# Altium schematic sheet BLE.SchDoc: RF/Bluetooth
size B; Author: Sébastien Gélinas; Organization: SmartHalo; Address1: 5445 de Gaspé; Address2: Montréal, QC; Address3: Canada; Address4: H2T 3B2; DocumentNumber: 4; Revision: 1; SheetNumber: 4; SheetTotal: 4
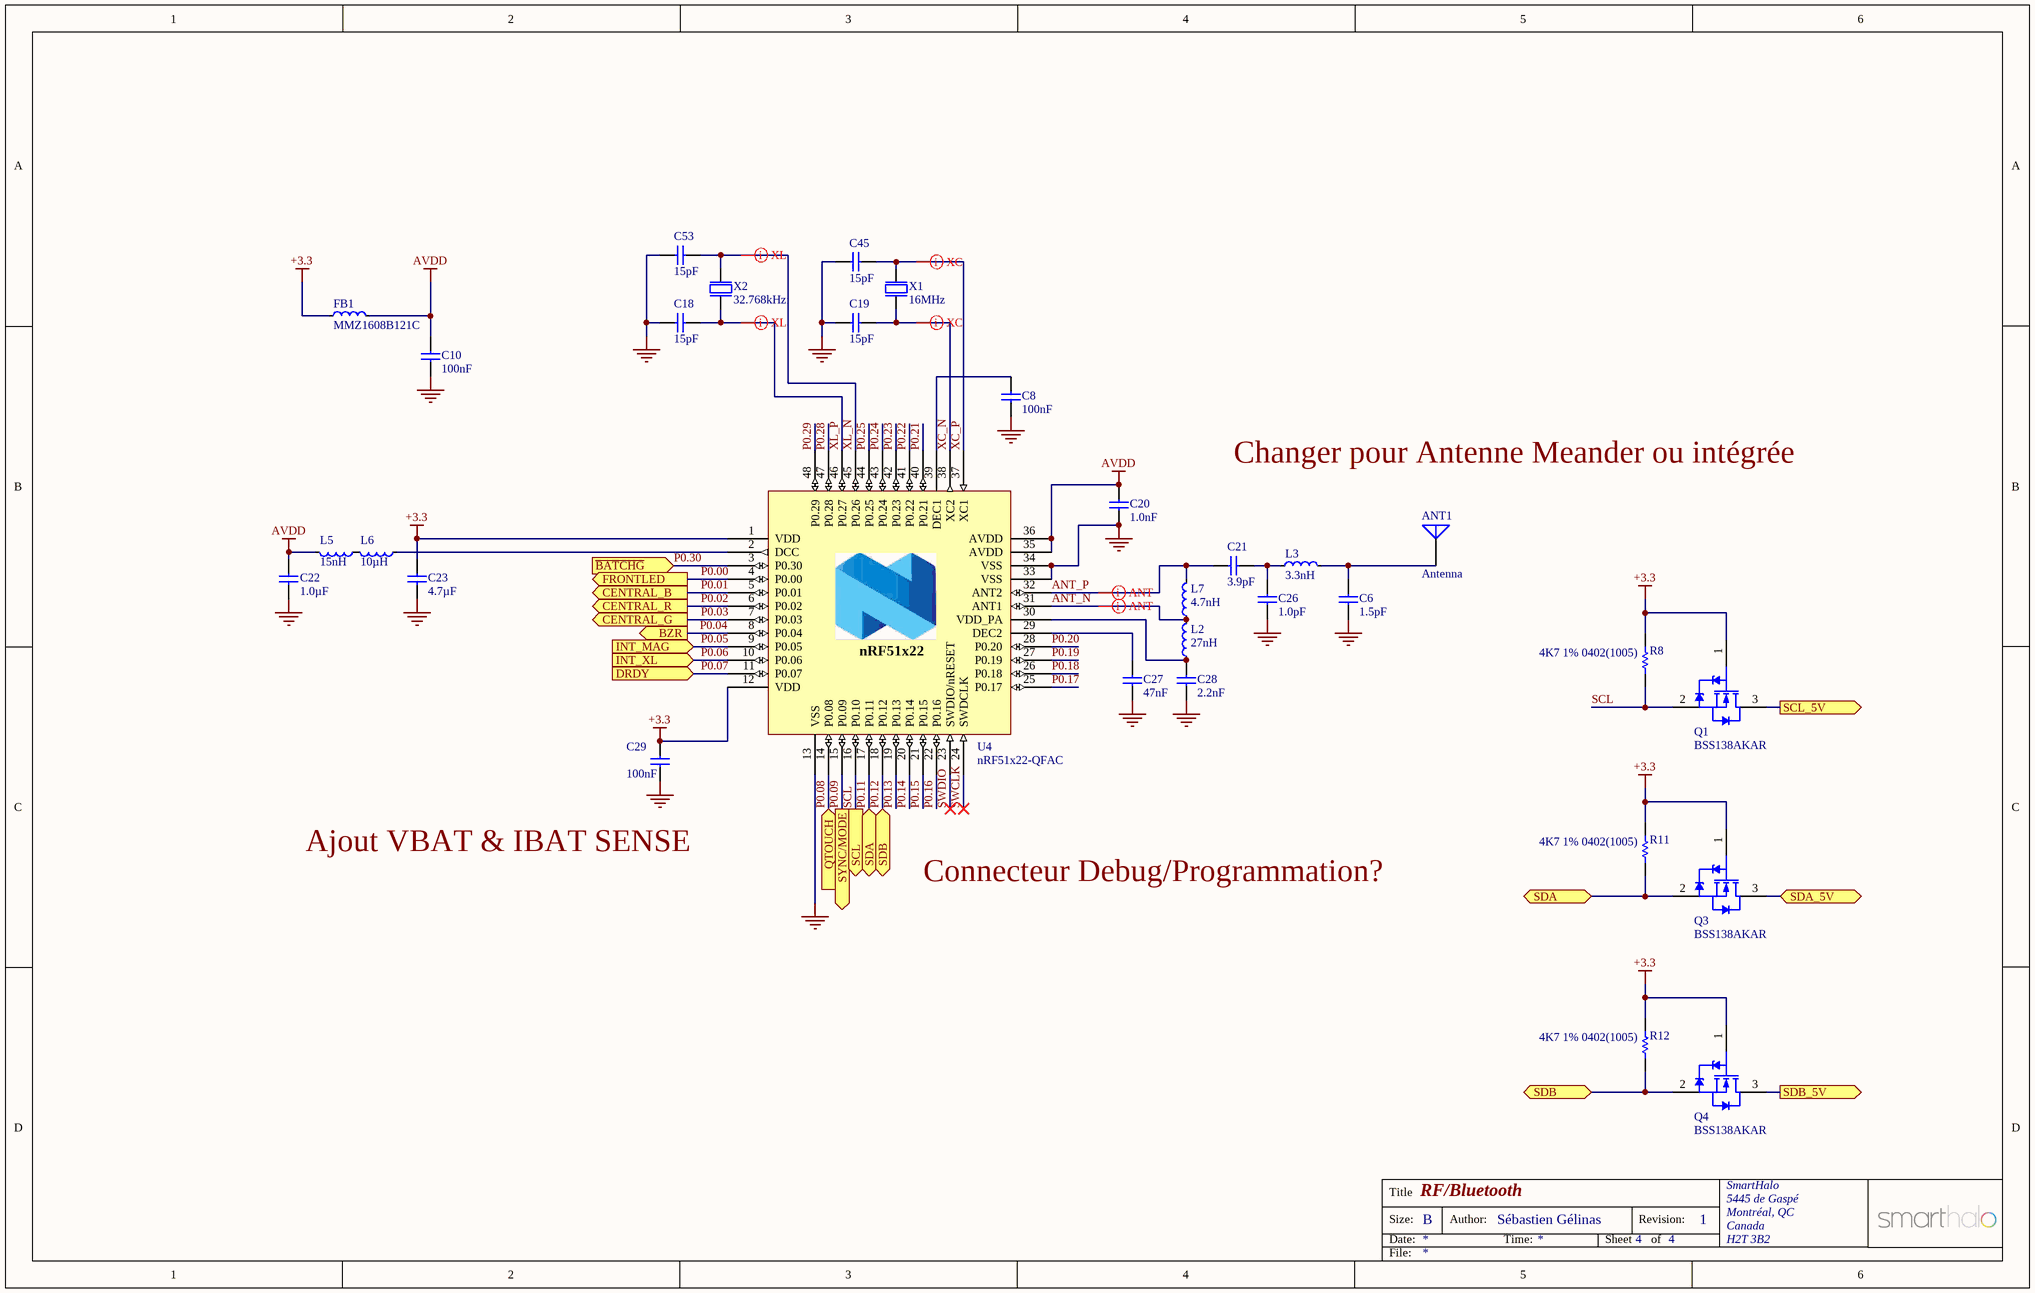
[diagram p0: BLE.SchDoc]

## Parts
ANT1  Antenna  [ANTENNA_PCB_2.4GHZ]  (no BOM)
C6  1.5pF  [CAPC1005X04L]
C8  100nF  [CAPC1005X04L]
C10  100nF  [CAPC0805(2012)100_N]
C18  15pF  [CAPC0805(2012)100_N]
C19  15pF  [CAPC0805(2012)100_N]
C20  1.0nF  [CAPC1005X04L]
C21  3.9pF  [CAPC1005X04L]
C22  1.0µF  [CAPC1608X06L]
C23  4.7µF  [CAPC1608X06L]
C26  1.0pF  [CAPC1005X04L]
C27  47nF  [CAPC1005X04L]
C28  2.2nF  [CAPC1005X04L]
C29  100nF  [CAPC1005X04L]
C45  15pF  [CAPC0805(2012)100_N]
C53  15pF  [CAPC0805(2012)100_N]
FB1  MMZ1608B121C  [CAPC0805(2012)100_N]
L2  27nH  [INDC1005X04L]
L3  3.3nH  [INDC1005X04L]
L5  15nH  [INDC1005X04L]
L6  10µH  [INDC1608X06L]
L7  4.7nH  [INDC1005X04L]
Q1  BSS138AKAR  [NXP-SOT23_N]
Q3  BSS138AKAR  [NXP-SOT23_N]
Q4  BSS138AKAR  [NXP-SOT23_N]
R8  4K7 1% 0402(1005)  [RESC0402(1005)_N]
R11  4K7 1% 0402(1005)  [RESC0402(1005)_N]
R12  4K7 1% 0402(1005)  [RESC0402(1005)_N]
U4  nRF51x22-QFAC  [QFN40P600X600X90-48N]
X1  16MHz  [CRYSTAL_16MHz_SMT4]
X2  32.768kHz  [CRYSTAL_32.768kHz_SMT2]

## Ports
BZR (out), CENTRAL_B (out), CENTRAL_G (out), CENTRAL_R (out), DRDY (in), FRONTLED (out), INT_MAG (in), INT_XL (in), QTOUCH (in), SCL (out), SCL_5V (out), SDA (bidir), SDA_5V (bidir), SDB (bidir), SDB_5V (out), SYNC/MODE (out), ~{BATCHG} (in)

## Nets
+3.3: C23.1 C29.1 FB1.1 Q1.1(G) Q3.1(G) Q4.1(G) R8.2 R11.2 R12.2 U4.1(VDD) U4.12(VDD)
AVDD: C10.2 C20.1 C22.2 FB1.2 L5.2 U4.35(AVDD) U4.36(AVDD)
GND: C6.2 C8.2 C10.1 C18.1 C19.2 C20.2 C22.1 C23.2 C26.2 C27.2 C28.2 C29.2 C45.2 C53.1 U4.13(VSS) U4.33(VSS) U4.34(VSS) U4.49 X1.2(GND) X1.4(GND)
ANT_N: L2.2 L7.1 U4.31(ANT1)
ANT_P: C21.1 L7.2 U4.32(ANT2)
P0.00: U4.4(P0.00) ; port FRONTLED
P0.01: U4.5(P0.01) ; port CENTRAL_B
P0.02: U4.6(P0.02) ; port CENTRAL_R
P0.03: U4.7(P0.03) ; port CENTRAL_G
P0.04: U4.8(P0.04) ; port BZR
P0.05: U4.9(P0.05) ; port INT_MAG
P0.06: U4.10(P0.06) ; port INT_XL
P0.07: U4.11(P0.07) ; port DRDY
P0.08: U4.14(P0.08) ; port QTOUCH
P0.09: U4.15(P0.09) ; port SYNC/MODE
P0.11: Q3.2(S) R11.1 U4.17(P0.11) ; port SDA
P0.12: Q4.2(S) R12.1 U4.18(P0.12) ; port SDB
P0.13: U4.19(P0.13)
P0.14: U4.20(P0.14)
P0.15: U4.21(P0.15)
P0.16: U4.22(P0.16)
P0.17: U4.25(P0.17)
P0.18: U4.26(P0.18)
P0.19: U4.27(P0.19)
P0.20: U4.28(P0.20)
P0.21: U4.40(P0.21)
P0.22: U4.41(P0.22)
P0.23: U4.42(P0.23)
P0.24: U4.43(P0.24)
P0.25: U4.44(P0.25)
P0.28: U4.47(P0.28)
P0.29: U4.48(P0.29)
P0.30: U4.3(P0.30) ; port ~{BATCHG}
SCL: Q1.2(S) R8.1 U4.16(P0.10) ; port SCL
SCL_5V: Q1.3(D) ; port SCL_5V
SDA_5V: Q3.3(D) ; port SDA_5V
SDB_5V: Q4.3(D) ; port SDB_5V
SWCLK: U4.24(SWDCLK)
SWDIO: U4.23(SWDIO/nRESET)
XC_N: C19.1 U4.38(XC2) X1.1(inp)
XC_P: C45.1 U4.37(XC1) X1.3(out)
XL_N: C53.2 U4.45(P0.26) X2.1(inp)
XL_P: C18.2 U4.46(P0.27) X2.2(out)
NetANT1_1: ANT1.1 C6.1 L3.2
NetC8_1: C8.1 U4.39(DEC1)
NetC21_2: C21.2 C26.1 L3.1
NetC27_1: C27.1 U4.29(DEC2)
NetC28_1: C28.1 L2.1 U4.30(VDD_PA)
NetL5_1: L5.1 L6.2
NetL6_1: L6.1 U4.2(DCC)

## Layout directives
differential pair: ANT_N, ANT_P, XC_N, XC_P, XL_N, XL_P

## Notes on the sheet
- Changer pour Antenne Meander ou intégrée
- Ajout VBAT & IBAT SENSE
- Connecteur Debug/Programmation?
- Title
- Size:
- Date:
- B
- Author:
- Time:
- Sheet
- Revision:
- of
- File:
- (in symbol nRF51x22_QFAx) nRF51x22

## Library data of the parts
ANT1 = ANTENNA_PCB_2.4GHz: Antenna PCB, 2.4GHz, 26.11 mm x 1.27 mm, FR4 60 mils, Er = 4.2
C6 = C0402-1.5p: Capacitor, NP0, ±0.1pF; Note: 50V; Artikkelnr Noca: 20029139; Artikkelnr Simpro: N.A.; Part Number: C0402-1.5p; Manufacturer: *; Manufacturer Part Number: *; Datasheet: *; LatestRevisionDate: 2009-11-23; Pin Count: 2; Publisher: Nordic Semiconductor; Published: 2009-05-08; Value: 1.5pF; Supplier: *; Supplier part number: *; 2nd source Supplier: *; 2nd source part number: *; Footprint Doc: 0402
C8 C29 = C0402-100n: Capacitor, X7R, ±10%; Note: 16V; Artikkelnr Noca: 20039200; Artikkelnr Simpro: N.A.; Part Number: C0402-100n; Manufacturer: *; Manufacturer Part Number: *; Datasheet: *; LatestRevisionDate: 2009-11-23; Pin Count: 2; Publisher: Nordic Semiconductor; Published: 2009-05-08; Value: 100nF; Supplier: *; Supplier part number: *; 2nd source Supplier: *; 2nd source part number: *; Footprint Doc: 0402
C10 = C0402-100n: CAP 100nF *V ±10% X7R 0805 (2012 Metric); Case-EIA: 0805; Case-Metric: 2012; Capacitance: 100nF; Rated Voltage: *; Tolerance: ±10%; Dielectric: X7R
C18 C19 C45 C53 = C0402-15p: CAP 15pF *V ±5% NP0 0805 (2012 Metric); Case-EIA: 0805; Case-Metric: 2012; Capacitance: 15pF; Dielectric: NP0; Rated Voltage: *; Tolerance: ±5%
C20 = C0402-1n0: Capacitor, X7R, ±10%; Note: 50V; Artikkelnr Noca: 20039223; Artikkelnr Simpro: N.A.; Part Number: C0402-1n0; Manufacturer: *; Manufacturer Part Number: *; Datasheet: *; LatestRevisionDate: 2009-11-23; Pin Count: 2; Publisher: Nordic Semiconductor; Published: 2009-05-08; Value: 1.0nF; Supplier: *; Supplier part number: *; 2nd source Supplier: *; 2nd source part number: *; Footprint Doc: 0402
C21 = C0402-3.9p: Capacitor, NP0, ±0.1pF; Note: 50V; Artikkelnr Noca: N.A.; Part Number: C0402-3.9p; Manufacturer: *; Manufacturer Part Number: *; Datasheet: *; LatestRevisionDate: 2014-09-17; Pin Count: 2; Publisher: Nordic Semiconductor; Published: 2009-05-08; Value: 3.9pF; Supplier: *; Supplier part number: *; 2nd source Supplier: *; 2nd source part number: *; Footprint Doc: 0402; Artikkelnr Simpro: N.A.
C22 = C0603-1µ0: Capacitor, X7R, ±10%; Note: 16V; Artikkelnr Noca: 20039335; Artikkelnr Simpro: N.A.; Part Number: C0603-1µ0; Manufacturer: *; Manufacturer Part Number: *; Datasheet: *; LatestRevisionDate: 2013-06-05; Pin Count: 2; Publisher: Nordic Semiconductor; Published: 2009-05-08; Value: 1.0µF; Supplier: *; Supplier part number: *; 2nd source Supplier: *; 2nd source part number: *; Footprint Doc: 0603
C23 = C0603-4µ7: Capacitor, X5R, ±10%; Note: 6.3V; Artikkelnr Noca: 20069060; Artikkelnr Simpro: N.A.; Part Number: C0603-4µ7; Manufacturer: *; Manufacturer Part Number: *; Datasheet: *; LatestRevisionDate: 2009-11-23; Pin Count: 2; Publisher: Nordic Semiconductor; Published: 2009-05-08; Value: 4.7µF; Supplier: *; Supplier part number: *; 2nd source Supplier: *; 2nd source part number: *; Footprint Doc: 0603
C26 = C0402-1.0p: Capacitor, NP0, ±0.1pF; Note: 50V; Artikkelnr Noca: 20029140; Artikkelnr Simpro: N.A.; Part Number: C0402-1.0p; Manufacturer: *; Manufacturer Part Number: *; Datasheet: *; LatestRevisionDate: 2009-11-23; Pin Count: 2; Publisher: Nordic Semiconductor; Published: 2009-05-08; Value: 1.0pF; Supplier: *; Supplier part number: *; 2nd source Supplier: *; 2nd source part number: *; Footprint Doc: 0402
C27 = C0402-47n: Capacitor, X7R, ±10%; Note: Chip Cap 10%; Artikkelnr Noca: 20039389; Artikkelnr Simpro: N.A.; Part Number: C0402-47n; Manufacturer: *; Manufacturer Part Number: *; Datasheet: *; LatestRevisionDate: 2009-05-08; Pin Count: 2; Publisher: Nordic Semiconductor; Published: 2009-05-08; Value: 47nF; Supplier: *; Supplier part number: *; 2nd source Supplier: *; 2nd source part number: *; Footprint Doc: 0402
C28 = C0402-2n2: Capacitor, X7R, ±10%; Note: 50V; Artikkelnr Noca: 20039221; Artikkelnr Simpro: N.A.; Part Number: C0402-2n2; Manufacturer: *; Manufacturer Part Number: *; Datasheet: *; LatestRevisionDate: 2009-11-23; Pin Count: 2; Publisher: Nordic Semiconductor; Published: 2009-05-08; Value: 2.2nF; Supplier: *; Supplier part number: *; 2nd source Supplier: *; 2nd source part number: *; Footprint Doc: 0402
FB1 = L0402-15n: Ferrite bead 0805; Case-EIA: 0805; Case-Metric: 2012
L2 = L0402-27n: High frequency chip inductor ±5%; Manufacturer: Murata; Manufacturer Part Number: LQP15MN27NG02D; Note: High frequency chip inductor ±2%; Artikkelnr Noca: N.A.; Part Number: L0402-27n; Datasheet: http://search.murata.co.jp/Ceramy/image/img/PDF/ENG/L0075S0084LQP15M.pdf; LatestRevisionDate: 2014-09-17; Pin Count: 2; Publisher: Nordic Semiconductor; Published: 2014-06-12; Value: 27nH; Supplier: Digi-Key; Supplier part number: 490-6751-1-ND; 2nd source Supplier: *; 2nd source part number: *; Footprint Doc: 0402; Artikkelnr Simpro: N.A.
L3 = L0402-3n3: High frequency chip inductor ±5%; Manufacturer: Murata; Manufacturer Part Number: LQP15MN3N3B02D; Artikkelnr Noca: 33029369; Artikkelnr Simpro: N.A.; Part Number: L0402-3n3; Datasheet: http://search.murata.co.jp/Ceramy/image/img/PDF/ENG/L0075S0084LQP15M.pdf; LatestRevisionDate: 2012-09-19; Pin Count: 2; Publisher: Nordic Semiconductor; Published: 2009-05-08; Value: 3.3nH; Note: High frequency chip inductor ±5%; Supplier: Digi-Key; Supplier part number: 490-1130-1-ND; 2nd source Supplier: *; 2nd source part number: *; Footprint Doc: 0402
L5 = L0402-15n: High frequency chip inductor ±10%; Manufacturer: Taiyo Yuden; Manufacturer Part Number: HK100515NJ-T; 2nd source part number: 658-1328; Artikkelnr Noca: 33029323; Artikkelnr Simpro: N.A.; Part Number: L0402-15n; LatestRevisionDate: 2012-09-19; Pin Count: 2; Publisher: Nordic Semiconductor; Published: 2010-07-12; Value: 15nH; Note: High frequency chip inductor ±10%; Supplier: Digi-Key; Datasheet: http://www.yuden.co.jp/productdata/catalog/en/mlci04_e.pdf; Supplier part number: 587-1521-1-ND; 2nd source Supplier: Farnell; Footprint Doc: 0402
L6 = L0603-10µ: Chip inductor, IDC,min = 50 mA, ±20%; Manufacturer: Taiyo Yuden; Manufacturer Part Number: LBMF1608T100K; 2nd source part number: 178-6105; Note: LBMF1608T100K 10µH 80mA 0603; Artikkelnr Noca: 33029314; Artikkelnr Simpro: N.A.; Part Number: L0603-10µ; Datasheet: http://www.yuden.co.jp/ut/product/pdf/elb2_e.pdf; LatestRevisionDate: 2012-09-19; Pin Count: 2; Publisher: Nordic Semiconductor; Published: 2010-02-24; Value: 10µH; Supplier: Digi-Key; Supplier part number: 587-1714-1-ND; 2nd source Supplier: Farnell; Footprint Doc: 0603
L7 = L0402-4n7: High frequency chip inductor ±5%; Manufacturer: Murata; Manufacturer Part Number: LQP15MN4N7B02D; Artikkelnr Noca: 33029164; Artikkelnr Simpro: N.A.; Part Number: L0402-4n7; Datasheet: http://search.murata.co.jp/Ceramy/image/img/PDF/ENG/L0075S0084LQP15M.pdf; LatestRevisionDate: 2012-09-19; Pin Count: 2; Publisher: Nordic Semiconductor; Published: 2009-05-08; Value: 4.7nH; Note: High frequency chip inductor ±5%; Supplier: Digi-Key; Supplier part number: 490-1132-1-ND; 2nd source Supplier: *; 2nd source part number: *; Footprint Doc: 0402
Q1 Q3 Q4 = CMP-1258-00119-1: Single N-Channel Trench MOSFET, 60 V, 0.2 A, -55 to 150 degC, 3-Pin SOT23, Tape and Reel; Manufacturer: NXP Semiconductors; ID [max] (A): 0.2; VGSth [typ] (V): 1.2; VDS [max] (V): 60; Coss [typ] (pF): 21; Ciss [typ] (pF): 31; Channel Type: N; Packing: Tape & Reel; ComponentLink1URL: http://www.nxp.com/; ComponentLink2URL: http://www.nxp.com/documents/data_sheet/BSS138AKA.pdf; ComponentLink3Description: Package Specification; PackageVersion: 06-03-16, 03/2006; ComponentLink2Description: Datasheet; ComponentLink3URL: http://www.nxp.com/documents/outline_drawing/sot023_po.pdf; PackageDescription: 3-Pin Small Outline Transistor Package, Body 2.9 x 1.3 mm, Pitch 0.95 mm; ComponentLink1Description: Manufacturer URL; PackageReference: SOT23; Code_JEDEC: TO-236AB; DatasheetVersion: Rev. 1; Mounting Technology: Surface Mount; PartNumber: BSS138AKAR
R8 R11 R12 = CMP-1011-00586-1: 4K7 0.063W 1% 0402 (1005 Metric)  SMD; Case-Metric: 1005; Value: 4700.00 Ohm; Case-EIA: 0402; Power: 0.063 W; Technology: SMT; Tolerance: 1 %
U4 = nRF51x22_QFAx: Multi-protocol Bluetooth Low Energy, ANT and 2.4GHz proprietary system-on-chip; Manufacturer: Nordic Semiconductor; Note: nRF51422 - QFN48 6x6 0.4mm pitch; Artikkelnr Noca: N.A.; Part Number: nRF51x22-QFAC; Manufacturer Part Number: nRF51x22-QFAC; Datasheet: *; LatestRevisionDate: 2014-09-24; Pin Count: 48; Publisher: Nordic Semiconductor; Published: 2014-09-24; Value: nRF51x22-QFAC; Supplier: Nordic Semiconductor; Supplier part number: *; 2nd source Supplier: *; 2nd source part number: *; Footprint Doc: QFN-48; Artikkelnr Simpro: N.A.
X1 = XTAL_TSX-3225: XTAL SMD 16MHz, 9pF, Mercury; Part Number: XTAL SMD 16MHz (3225); Note: XTAL SMD 16MHz 3225; Artikkelnr Noca: 22019087; Value: 16MHz; Manufacturer: *; Manufacturer Part Number: *; Datasheet: http://ndap3-net.ebz.epson.co.jp/w/www/PDFS/epdoc_qd.nsf/85a4e2c523a1f89349257068002f9e30/31e98956c8f991cd4925707c003b38b1/$FILE/FA-238_238V_TSX-3225_E08X.pdf; Footprint: BT-XTAL_3225; LatestRevisionDate: 2010-02-24; Pin Count: 4; Publisher: Nordic Semiconductor; Published: 2009-05-30; Supplier: *; Supplier part number: *; 2nd source Supplier: *; 2nd source part number: *
X2 = XTAL_FC-135 32.768k: EPSON TOYOCOM - FC-135 32.768KHZ ±20PPM,9.0PF - CRYSTAL, SM, WATCH; Note: XTAL SMD 32.768kHz, 3215; Artikkelnr Noca: 2.20191e+007; Part Number: XTAL_FC-135 32.768k; Manufacturer: Epson Toyocom; Manufacturer Part Number: FC-135 32.768KHZ ±20PPM,9.0PF; Datasheet: http://www.farnell.com/datasheets/57480.pdf; Footprint: FC-135; LatestRevisionDate: 2010-10-18; Pin Count: 2; Publisher: Nordic Semiconductor; Published: 2010-10-18; Value: 32.768kHz; Supplier: Farnell; Supplier part number: 127-8037; 2nd source Supplier: *; 2nd source part number: *